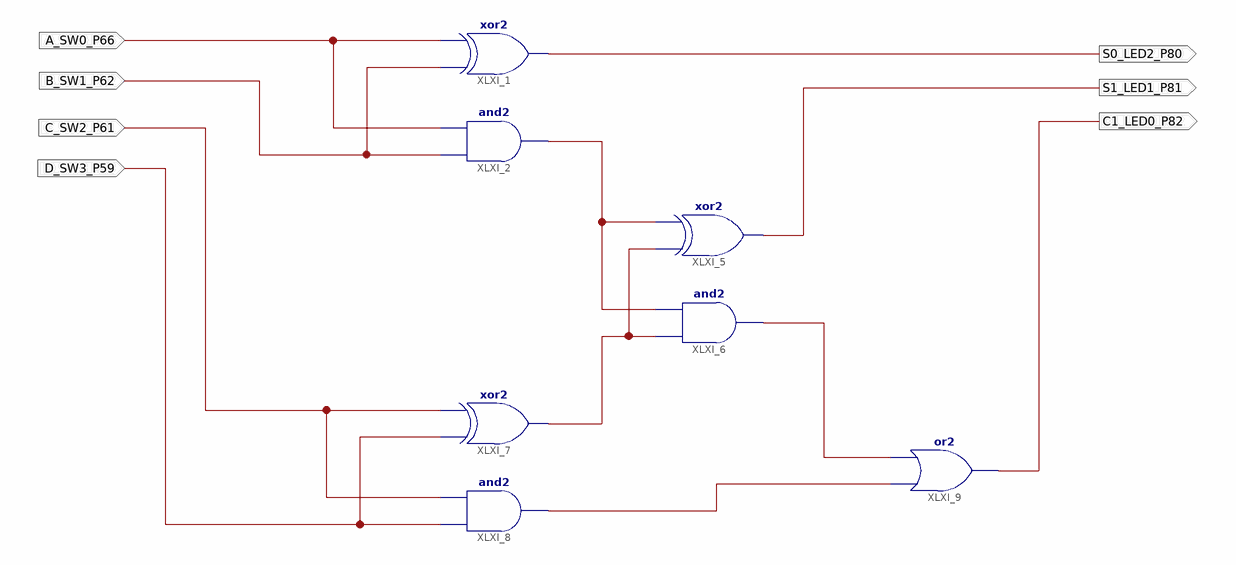
[diagram p0: schematic sheet 1]
// Xilinx ISE schematic TwoBitFullAdder.sch (spartan6) as structural Verilog: 7 symbols, 7 ports
module TwoBitFullAdder (
  input  D_SW3_P59,
  input  C_SW2_P61,
  input  B_SW1_P62,
  input  A_SW0_P66,
  output S0_LED2_P80,
  output S1_LED1_P81,
  output C1_LED0_P82
);

  wire XLXN_2, XLXN_9, XLXN_10, XLXN_11;

  xor XLXI_1 (S0_LED2_P80, B_SW1_P62, A_SW0_P66);
  and XLXI_2 (XLXN_2, B_SW1_P62, A_SW0_P66);
  xor XLXI_5 (S1_LED1_P81, XLXN_9, XLXN_2);
  and XLXI_6 (XLXN_10, XLXN_9, XLXN_2);
  xor XLXI_7 (XLXN_9, D_SW3_P59, C_SW2_P61);
  and XLXI_8 (XLXN_11, D_SW3_P59, C_SW2_P61);
  or XLXI_9 (C1_LED0_P82, XLXN_11, XLXN_10);
endmodule
